# EAGLE schematic Adafruit Proto Tripler PiCowbell (EAGLE 9.6.2)
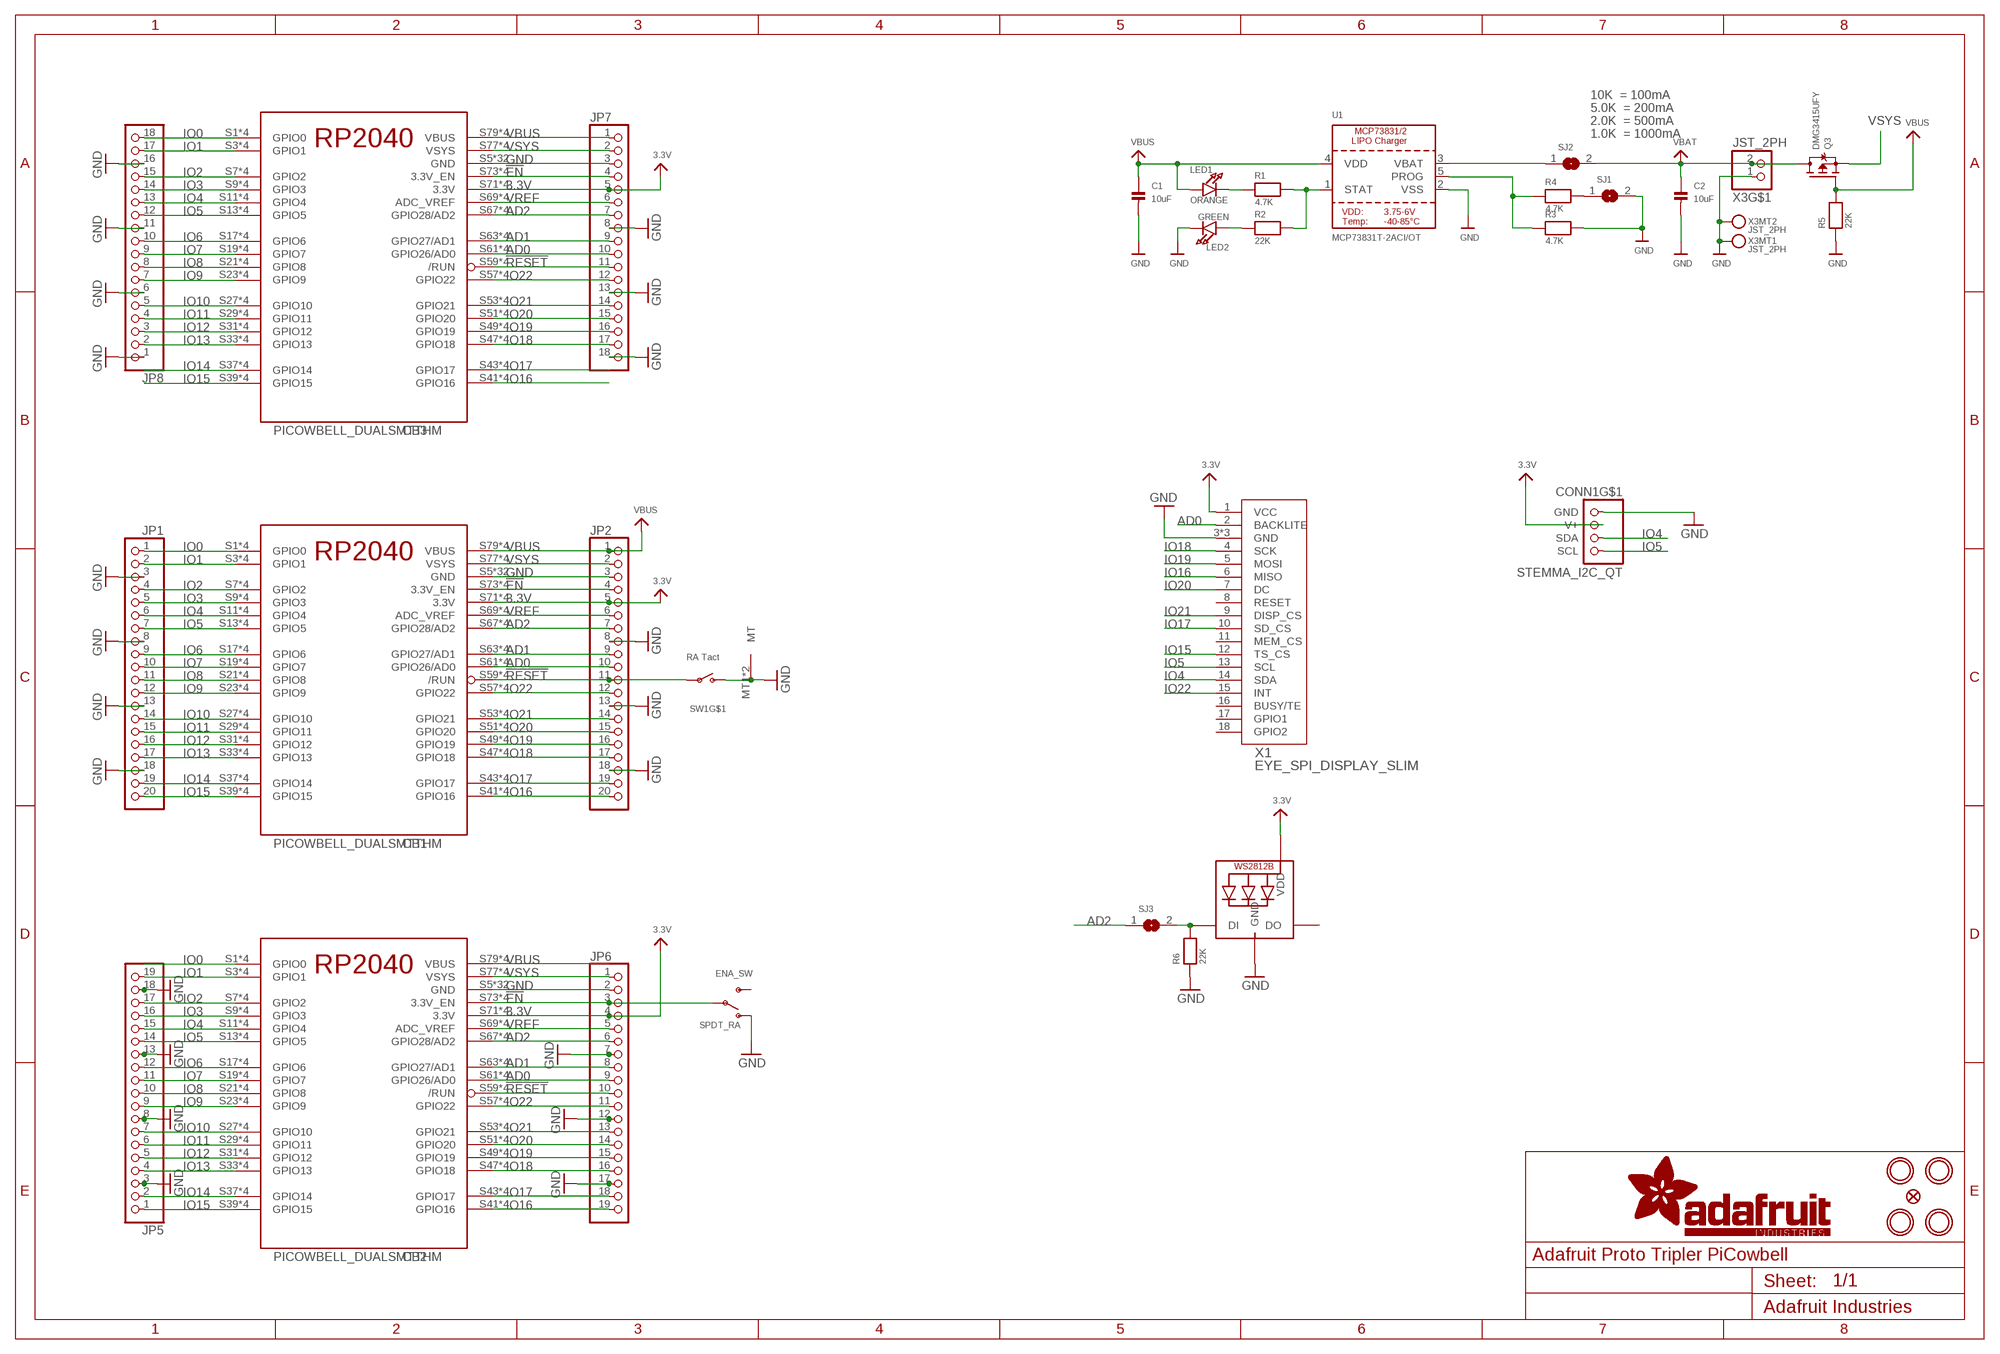
[diagram p0: schematic, sheet 1]

## Parts
C1  10uF  CAP_CERAMIC0805-NOOUTLINE  [0805-NO]
C2  10uF  CAP_CERAMIC0805-NOOUTLINE  [0805-NO]
CB1  PICOWBELL_DUALSMTTHM  [PICOWBELL_DUALSMTTHM]
CB2  PICOWBELL_DUALSMTTHM  [PICOWBELL_DUALSMTTHM]
CB3  PICOWBELL_DUALSMTTHM  [PICOWBELL_DUALSMTTHM]
CONN1  STEMMA_I2C_QT  [JST_SH4]
ENA_SW  SPDT_RA  SWITCH_SPDT  [SPDT_SMT_SSSS811101]
FID2  FIDUCIAL_1MM  [FIDUCIAL_1MM]
JP1  HEADER-1X20_70MIL  [1X20_ROUND_70MIL]
JP2  HEADER-1X20_70MIL  [1X20_ROUND_70MIL]
JP5  HEADER-1X19  [1X19_ROUND]
JP6  HEADER-1X19  [1X19_ROUND]
JP7  HEADER-1X18  [1X18_ROUND70]
JP8  HEADER-1X18  [1X18_ROUND70]
LED1  ORANGE  LED0603_NOOUTLINE  [CHIPLED_0603_NOOUTLINE]
LED2  GREEN  LED0603_NOOUTLINE  [CHIPLED_0603_NOOUTLINE]
LED3  WS2812B_3535FULL  [LED3535_FULLPADS]
Q3  DMG3415UFY  MOSFET-P_DFN2015  [DFN2015-3]
R1  4.7K  RESISTOR_0402NO  [_0402NO]
R2  22K  RESISTOR_0402NO  [_0402NO]
R3  4.7K  RESISTOR_0402NO  [_0402NO]
R4  4.7K  RESISTOR_0402NO  [_0402NO]
R5  22K  RESISTOR_0402NO  [_0402NO]
R6  22K  RESISTOR_0402NO  [_0402NO]
SJ1  SOLDERJUMPERCLOSED  [SOLDERJUMPER_CLOSEDWIRE]
SJ2  SOLDERJUMPERCLOSED  [SOLDERJUMPER_CLOSEDWIRE]
SJ3  SOLDERJUMPERCLOSED  [SOLDERJUMPER_CLOSEDWIRE]
SW1  RA Tact  SWITCH_SPST_MNT_TACT_RA  [SPST_TACTILE_RA]
U1  MCP73831T-2ACI/OT  MCP73831/2  [SOT23-5]
U$5  MOUNTINGHOLE2.5  [MOUNTINGHOLE_2.5_PLATED]
U$7  MOUNTINGHOLE2.5  [MOUNTINGHOLE_2.5_PLATED]
U$15  MOUNTINGHOLE2.5  [MOUNTINGHOLE_2.5_PLATED]
U$16  MOUNTINGHOLE2.5  [MOUNTINGHOLE_2.5_PLATED]
X1  EYE_SPI_DISPLAY_SLIM  [EYE_SPI_DISPLAY_SLIM]
X3  JST_2PH  CON_JST_PH_2PIN_MT_BATT  [JSTPH2_BATT]

## Nets
3.3V [3V]: CB1.S71(3.3V) CB1.S72(3.3V) CB1.T71(3.3V) CB1.T72(3.3V) CB2.S71(3.3V) CB2.S72(3.3V) CB2.T71(3.3V) CB2.T72(3.3V) CB3.S71(3.3V) CB3.S72(3.3V) CB3.T71(3.3V) CB3.T72(3.3V) CONN1.2(V+) JP2.5 JP6.4 JP7.5 LED3.2(VDD) X1.1(VCC)
!EN: CB1.S73(3.3V_EN) CB1.S74(3.3V_EN) CB1.T73(3.3V_EN) CB1.T74(3.3V_EN) CB2.S73(3.3V_EN) CB2.S74(3.3V_EN) CB2.T73(3.3V_EN) CB2.T74(3.3V_EN) CB3.S73(3.3V_EN) CB3.S74(3.3V_EN) CB3.T73(3.3V_EN) CB3.T74(3.3V_EN) ENA_SW.B(P) JP2.4 JP6.3 JP7.4
!RESET: CB1.S59(/RUN) CB1.S60(/RUN) CB1.T59(/RUN) CB1.T60(/RUN) CB2.S59(/RUN) CB2.S60(/RUN) CB2.T59(/RUN) CB2.T60(/RUN) CB3.S59(/RUN) CB3.S60(/RUN) CB3.T59(/RUN) CB3.T60(/RUN) JP2.11 JP6.10 JP7.11 SW1.1(P)
AD0: CB1.S61(GPIO26/AD0) CB1.S62(GPIO26/AD0) CB1.T61(GPIO26/AD0) CB1.T62(GPIO26/AD0) CB2.S61(GPIO26/AD0) CB2.S62(GPIO26/AD0) CB2.T61(GPIO26/AD0) CB2.T62(GPIO26/AD0) CB3.S61(GPIO26/AD0) CB3.S62(GPIO26/AD0) CB3.T61(GPIO26/AD0) CB3.T62(GPIO26/AD0) JP2.10 JP6.9 JP7.10 X1.2(BACKLITE)
AD1: CB1.S63(GPIO27/AD1) CB1.S64(GPIO27/AD1) CB1.T63(GPIO27/AD1) CB1.T64(GPIO27/AD1) CB2.S63(GPIO27/AD1) CB2.S64(GPIO27/AD1) CB2.T63(GPIO27/AD1) CB2.T64(GPIO27/AD1) CB3.S63(GPIO27/AD1) CB3.S64(GPIO27/AD1) CB3.T63(GPIO27/AD1) CB3.T64(GPIO27/AD1) JP2.9 JP6.8 JP7.9
AD2: CB1.S67(GPIO28/AD2) CB1.S68(GPIO28/AD2) CB1.T67(GPIO28/AD2) CB1.T68(GPIO28/AD2) CB2.S67(GPIO28/AD2) CB2.S68(GPIO28/AD2) CB2.T67(GPIO28/AD2) CB2.T68(GPIO28/AD2) CB3.S67(GPIO28/AD2) CB3.S68(GPIO28/AD2) CB3.T67(GPIO28/AD2) CB3.T68(GPIO28/AD2) JP2.7 JP6.6 JP7.7 SJ3.1
GND [GND]: C1.2 C2.2 CB1.S5(GND) CB1.S6(GND) CB1.S15(GND) CB1.S16(GND) CB1.S25(GND) CB1.S26(GND) CB1.S35(GND) CB1.S36(GND) CB1.S45(GND) CB1.S46(GND) CB1.S55(GND) CB1.S56(GND) CB1.S65(GND) CB1.S66(GND) CB1.S75(GND) CB1.S76(GND) CB1.T5(GND) CB1.T6(GND) CB1.T15(GND) CB1.T16(GND) CB1.T25(GND) CB1.T26(GND) CB1.T35(GND) CB1.T36(GND) CB1.T45(GND) CB1.T46(GND) CB1.T55(GND) CB1.T56(GND) CB1.T65(GND) CB1.T66(GND) CB1.T75(GND) CB1.T76(GND) CB2.S5(GND) CB2.S6(GND) CB2.S15(GND) CB2.S16(GND) CB2.S25(GND) CB2.S26(GND) CB2.S35(GND) CB2.S36(GND) CB2.S45(GND) CB2.S46(GND) CB2.S55(GND) CB2.S56(GND) CB2.S65(GND) CB2.S66(GND) CB2.S75(GND) CB2.S76(GND) CB2.T5(GND) CB2.T6(GND) CB2.T15(GND) CB2.T16(GND) CB2.T25(GND) CB2.T26(GND) CB2.T35(GND) CB2.T36(GND) CB2.T45(GND) CB2.T46(GND) CB2.T55(GND) CB2.T56(GND) CB2.T65(GND) CB2.T66(GND) CB2.T75(GND) CB2.T76(GND) CB3.S5(GND) CB3.S6(GND) CB3.S15(GND) CB3.S16(GND) CB3.S25(GND) CB3.S26(GND) CB3.S35(GND) CB3.S36(GND) CB3.S45(GND) CB3.S46(GND) CB3.S55(GND) CB3.S56(GND) CB3.S65(GND) CB3.S66(GND) CB3.S75(GND) CB3.S76(GND) CB3.T5(GND) CB3.T6(GND) CB3.T15(GND) CB3.T16(GND) CB3.T25(GND) CB3.T26(GND) CB3.T35(GND) CB3.T36(GND) CB3.T45(GND) CB3.T46(GND) CB3.T55(GND) CB3.T56(GND) CB3.T65(GND) CB3.T66(GND) CB3.T75(GND) CB3.T76(GND) CONN1.1(GND) ENA_SW.A(O) JP1.3 JP1.8 JP1.13 JP1.18 JP2.3 JP2.8 JP2.13 JP2.18 JP5.3 JP5.8 JP5.13 JP5.18 JP6.2 JP6.7 JP6.12 JP6.17 JP7.3 JP7.8 JP7.13 JP7.18 JP8.1 JP8.6 JP8.11 JP8.16 LED2.C LED3.4(GND) R3.2 R5.1 R6.1 SJ1.2 SW1.2(S) SW1.MT1(MT) SW1.MT2(MT) U1.2(VSS) X1.3(GND) X1.SUPPORT1(GND) X1.SUPPORT2(GND) X3.1 X3.NC1 X3.NC2
IO0: CB1.S1(GPIO0) CB1.S2(GPIO0) CB1.T1(GPIO0) CB1.T2(GPIO0) CB2.S1(GPIO0) CB2.S2(GPIO0) CB2.T1(GPIO0) CB2.T2(GPIO0) CB3.S1(GPIO0) CB3.S2(GPIO0) CB3.T1(GPIO0) CB3.T2(GPIO0) JP1.1 JP8.18
IO1: CB1.S3(GPIO1) CB1.S4(GPIO1) CB1.T3(GPIO1) CB1.T4(GPIO1) CB2.S3(GPIO1) CB2.S4(GPIO1) CB2.T3(GPIO1) CB2.T4(GPIO1) CB3.S3(GPIO1) CB3.S4(GPIO1) CB3.T3(GPIO1) CB3.T4(GPIO1) JP1.2 JP5.19 JP8.17
IO2: CB1.S7(GPIO2) CB1.S8(GPIO2) CB1.T7(GPIO2) CB1.T8(GPIO2) CB2.S7(GPIO2) CB2.S8(GPIO2) CB2.T7(GPIO2) CB2.T8(GPIO2) CB3.S7(GPIO2) CB3.S8(GPIO2) CB3.T7(GPIO2) CB3.T8(GPIO2) JP1.4 JP5.17 JP8.15
IO3: CB1.S9(GPIO3) CB1.S10(GPIO3) CB1.T9(GPIO3) CB1.T10(GPIO3) CB2.S9(GPIO3) CB2.S10(GPIO3) CB2.T9(GPIO3) CB2.T10(GPIO3) CB3.S9(GPIO3) CB3.S10(GPIO3) CB3.T9(GPIO3) CB3.T10(GPIO3) JP1.5 JP5.16 JP8.14
IO4: CB1.S11(GPIO4) CB1.S12(GPIO4) CB1.T11(GPIO4) CB1.T12(GPIO4) CB2.S11(GPIO4) CB2.S12(GPIO4) CB2.T11(GPIO4) CB2.T12(GPIO4) CB3.S11(GPIO4) CB3.S12(GPIO4) CB3.T11(GPIO4) CB3.T12(GPIO4) CONN1.3(SDA) JP1.6 JP5.15 JP8.13 X1.14(SDA)
IO5: CB1.S13(GPIO5) CB1.S14(GPIO5) CB1.T13(GPIO5) CB1.T14(GPIO5) CB2.S13(GPIO5) CB2.S14(GPIO5) CB2.T13(GPIO5) CB2.T14(GPIO5) CB3.S13(GPIO5) CB3.S14(GPIO5) CB3.T13(GPIO5) CB3.T14(GPIO5) CONN1.4(SCL) JP1.7 JP5.14 JP8.12 X1.13(SCL)
IO6: CB1.S17(GPIO6) CB1.S18(GPIO6) CB1.T17(GPIO6) CB1.T18(GPIO6) CB2.S17(GPIO6) CB2.S18(GPIO6) CB2.T17(GPIO6) CB2.T18(GPIO6) CB3.S17(GPIO6) CB3.S18(GPIO6) CB3.T17(GPIO6) CB3.T18(GPIO6) JP1.9 JP5.12 JP8.10
IO7: CB1.S19(GPIO7) CB1.S20(GPIO7) CB1.T19(GPIO7) CB1.T20(GPIO7) CB2.S19(GPIO7) CB2.S20(GPIO7) CB2.T19(GPIO7) CB2.T20(GPIO7) CB3.S19(GPIO7) CB3.S20(GPIO7) CB3.T19(GPIO7) CB3.T20(GPIO7) JP1.10 JP5.11 JP8.9
IO8: CB1.S21(GPIO8) CB1.S22(GPIO8) CB1.T21(GPIO8) CB1.T22(GPIO8) CB2.S21(GPIO8) CB2.S22(GPIO8) CB2.T21(GPIO8) CB2.T22(GPIO8) CB3.S21(GPIO8) CB3.S22(GPIO8) CB3.T21(GPIO8) CB3.T22(GPIO8) JP1.11 JP5.10 JP8.8
IO9: CB1.S23(GPIO9) CB1.S24(GPIO9) CB1.T23(GPIO9) CB1.T24(GPIO9) CB2.S23(GPIO9) CB2.S24(GPIO9) CB2.T23(GPIO9) CB2.T24(GPIO9) CB3.S23(GPIO9) CB3.S24(GPIO9) CB3.T23(GPIO9) CB3.T24(GPIO9) JP1.12 JP5.9 JP8.7
IO10: CB1.S27(GPIO10) CB1.S28(GPIO10) CB1.T27(GPIO10) CB1.T28(GPIO10) CB2.S27(GPIO10) CB2.S28(GPIO10) CB2.T27(GPIO10) CB2.T28(GPIO10) CB3.S27(GPIO10) CB3.S28(GPIO10) CB3.T27(GPIO10) CB3.T28(GPIO10) JP1.14 JP5.7 JP8.5
IO11: CB1.S29(GPIO11) CB1.S30(GPIO11) CB1.T29(GPIO11) CB1.T30(GPIO11) CB2.S29(GPIO11) CB2.S30(GPIO11) CB2.T29(GPIO11) CB2.T30(GPIO11) CB3.S29(GPIO11) CB3.S30(GPIO11) CB3.T29(GPIO11) CB3.T30(GPIO11) JP1.15 JP5.6 JP8.4
IO12: CB1.S31(GPIO12) CB1.S32(GPIO12) CB1.T31(GPIO12) CB1.T32(GPIO12) CB2.S31(GPIO12) CB2.S32(GPIO12) CB2.T31(GPIO12) CB2.T32(GPIO12) CB3.S31(GPIO12) CB3.S32(GPIO12) CB3.T31(GPIO12) CB3.T32(GPIO12) JP1.16 JP5.5 JP8.3
IO13: CB1.S33(GPIO13) CB1.S34(GPIO13) CB1.T33(GPIO13) CB1.T34(GPIO13) CB2.S33(GPIO13) CB2.S34(GPIO13) CB2.T33(GPIO13) CB2.T34(GPIO13) CB3.S33(GPIO13) CB3.S34(GPIO13) CB3.T33(GPIO13) CB3.T34(GPIO13) JP1.17 JP5.4 JP8.2
IO14: CB1.S37(GPIO14) CB1.S38(GPIO14) CB1.T37(GPIO14) CB1.T38(GPIO14) CB2.S37(GPIO14) CB2.S38(GPIO14) CB2.T37(GPIO14) CB2.T38(GPIO14) CB3.S37(GPIO14) CB3.S38(GPIO14) CB3.T37(GPIO14) CB3.T38(GPIO14) JP1.19 JP5.2
IO15: CB1.S39(GPIO15) CB1.S40(GPIO15) CB1.T39(GPIO15) CB1.T40(GPIO15) CB2.S39(GPIO15) CB2.S40(GPIO15) CB2.T39(GPIO15) CB2.T40(GPIO15) CB3.S39(GPIO15) CB3.S40(GPIO15) CB3.T39(GPIO15) CB3.T40(GPIO15) JP1.20 JP5.1 X1.12(TS_CS)
IO16: CB1.S41(GPIO16) CB1.S42(GPIO16) CB1.T41(GPIO16) CB1.T42(GPIO16) CB2.S41(GPIO16) CB2.S42(GPIO16) CB2.T41(GPIO16) CB2.T42(GPIO16) CB3.S41(GPIO16) CB3.S42(GPIO16) CB3.T41(GPIO16) CB3.T42(GPIO16) JP2.20 JP6.19 X1.6(MISO)
IO17: CB1.S43(GPIO17) CB1.S44(GPIO17) CB1.T43(GPIO17) CB1.T44(GPIO17) CB2.S43(GPIO17) CB2.S44(GPIO17) CB2.T43(GPIO17) CB2.T44(GPIO17) CB3.S43(GPIO17) CB3.S44(GPIO17) CB3.T43(GPIO17) CB3.T44(GPIO17) JP2.19 JP6.18 X1.10(SD_CS)
IO18: CB1.S47(GPIO18) CB1.S48(GPIO18) CB1.T47(GPIO18) CB1.T48(GPIO18) CB2.S47(GPIO18) CB2.S48(GPIO18) CB2.T47(GPIO18) CB2.T48(GPIO18) CB3.S47(GPIO18) CB3.S48(GPIO18) CB3.T47(GPIO18) CB3.T48(GPIO18) JP2.17 JP6.16 JP7.17 X1.4(SCK)
IO19: CB1.S49(GPIO19) CB1.S50(GPIO19) CB1.T49(GPIO19) CB1.T50(GPIO19) CB2.S49(GPIO19) CB2.S50(GPIO19) CB2.T49(GPIO19) CB2.T50(GPIO19) CB3.S49(GPIO19) CB3.S50(GPIO19) CB3.T49(GPIO19) CB3.T50(GPIO19) JP2.16 JP6.15 JP7.16 X1.5(MOSI)
IO20: CB1.S51(GPIO20) CB1.S52(GPIO20) CB1.T51(GPIO20) CB1.T52(GPIO20) CB2.S51(GPIO20) CB2.S52(GPIO20) CB2.T51(GPIO20) CB2.T52(GPIO20) CB3.S51(GPIO20) CB3.S52(GPIO20) CB3.T51(GPIO20) CB3.T52(GPIO20) JP2.15 JP6.14 JP7.15 X1.7(DC)
IO21: CB1.S53(GPIO21) CB1.S54(GPIO21) CB1.T53(GPIO21) CB1.T54(GPIO21) CB2.S53(GPIO21) CB2.S54(GPIO21) CB2.T53(GPIO21) CB2.T54(GPIO21) CB3.S53(GPIO21) CB3.S54(GPIO21) CB3.T53(GPIO21) CB3.T54(GPIO21) JP2.14 JP6.13 JP7.14 X1.9(DISP_CS)
IO22: CB1.S57(GPIO22) CB1.S58(GPIO22) CB1.T57(GPIO22) CB1.T58(GPIO22) CB2.S57(GPIO22) CB2.S58(GPIO22) CB2.T57(GPIO22) CB2.T58(GPIO22) CB3.S57(GPIO22) CB3.S58(GPIO22) CB3.T57(GPIO22) CB3.T58(GPIO22) JP2.12 JP6.11 JP7.12 X1.15(INT)
N$1: R4.2 SJ1.1
N$2: SJ2.1 U1.3(VBAT)
N$4: LED1.C R1.1
N$5: R1.2 R2.2 U1.1(STAT)
N$7: LED2.A R2.1
N$8: R3.1 R4.1 U1.5(PROG)
N$11: LED3.1(DI) R6.2 SJ3.2
VBAT: C2.1 Q3.3(D) SJ2.2 X3.2
VBUS [VBUS]: C1.1 CB1.S79(VBUS) CB1.S80(VBUS) CB1.T79(VBUS) CB1.T80(VBUS) CB2.S79(VBUS) CB2.S80(VBUS) CB2.T79(VBUS) CB2.T80(VBUS) CB3.S79(VBUS) CB3.S80(VBUS) CB3.T79(VBUS) CB3.T80(VBUS) JP2.1 JP7.1 LED1.A Q3.1(G) R5.2 U1.4(VDD)
VREF: CB1.S69(ADC_VREF) CB1.S70(ADC_VREF) CB1.T69(ADC_VREF) CB1.T70(ADC_VREF) CB2.S69(ADC_VREF) CB2.S70(ADC_VREF) CB2.T69(ADC_VREF) CB2.T70(ADC_VREF) CB3.S69(ADC_VREF) CB3.S70(ADC_VREF) CB3.T69(ADC_VREF) CB3.T70(ADC_VREF) JP2.6 JP6.5 JP7.6
VSYS [VSYS]: CB1.S77(VSYS) CB1.S78(VSYS) CB1.T77(VSYS) CB1.T78(VSYS) CB2.S77(VSYS) CB2.S78(VSYS) CB2.T77(VSYS) CB2.T78(VSYS) CB3.S77(VSYS) CB3.S78(VSYS) CB3.T77(VSYS) CB3.T78(VSYS) JP2.2 JP6.1 JP7.2 Q3.2(S)
Unconnected: CONN1.MT1(MT) CONN1.MT2(MT) ENA_SW.C(S) LED3.3(DO) X1.8(RESET) X1.11(MEM_CS) X1.16(BUSY/TE) X1.17(GPIO1) X1.18(GPIO2)

## Notes on the sheet
- 10K  = 100mA
- 5.0K  = 200mA
- 2.0K  = 500mA
- 1.0K  = 1000mA

## Library data of the parts
C1 C2 = microbuilder:CAP_CERAMIC: Ceramic Capacitors For new designs, use the packages preceded by an '_' character since they are more reliable: The following footprints should be used on most boards: _0402 - Standard footprint for regular board layouts _0603 - Standard footprint for regular board layouts _0805 - Standard footprint for regular board layouts _1206 - Standard footprint for regular board layouts For extremely tight-pitch boards where space is at a premium, the following 'micro-pitch' footprints can be used (smaller pads, no silkscreen outline, etc.): _0402MP - Micro-pitch footprint for very dense/compact boards _0603MP - Micro-pitch footprint for very dense/compact boards _0805MP - Micro-pitch footprint for very dense/compact boards _1206MP - Micro-pitch footprint for very dense/compact boards
CB1-CB3 = adafruit_micro:PICOWBELL
CONN1 = adafruit_electromech:STEMMA_I2C; LCSC: C2845363
ENA_SW = adafruit_electromech:SWITCH_SPDT: Switch - SPDT SSSS811101 - Horizontal Two Position SMT, 0.3A 4V [Mouser: 688-SSSS811101]
FID2 = microbuilder:FIDUCIAL: Fiducial Alignment Points Various fiducial points for machine vision alignment.; BOM: EXCLUDE
JP1 JP2 = adafruit_electromech:HEADER-1X20
JP5 JP6 = microbuilder:HEADER-1X19
JP7 JP8 = microbuilder:HEADER-1X18: Header 1x18
LED1 LED2 = microbuilder:LED: LED 0603 - 0603 Surface Mount Package 2mA: Green LED - Low Power (3.9mcd, 2ma, 1.7Vf) - Digikey: 475-2709-2-ND Orange LED - Low Power (9.8mcd, 2ma, 1.8Vf) - Digikey: 475-1194-2-ND Red LED - Low Power (5mcd, 2ma, 1.8Vf) - Digikey: 475-1195-2-ND Yellow LED - Low Power (7mcd, 2ma, 1.8Vf) - Digikey: 475-1196-2-ND 5mA: Blue LED - Low Power (17mcd, 5ma, 2.9Vf) - Digikey: LNJ937W8CRACT-ND 0805 - 0805 Surface Mount Package 2mA: Red LED (8.8mcd, 2mA, 1.8Vf, Clear) - Low Power [Digikey: 475-2510-1-ND] Green LED (5mcd, 2mA, 1.8Vf, Clear) - Low Power [Digikey: 475-2730-1-ND] Yellow LED (11.3mcd, 2mA, 1.8Vf, Clear) - Low Power [Digikey: 475-2555-1-ND] 20mA: Red LED (104mcd, 20mA, Diffused) - LS R976 [Digikey: 475-1278-6-ND] Red LED (12mcd, 20mA, 2.0Vf, Clear) - APT2012EC [Digikey: 754-1128-1-ND] Green LED (15mcd, 20mA, 2.2Vf, Clear) - APT2012GC [Digikey: 754-1131-1-ND] Orange LED (160mcd, 20mA, 2.1Vf, Clear) - APT2012SECK [Digikey: 754-1130-1-ND] 1206 - 1206 Surface Mount Package Green LED (26mcd, 20mA, Diffused) - LG N971 [Digikey: 475-1407-6-ND] Red LED (15mcd, 20mA, Diffused) - LH N974 [Digikey: 475-1416-6-ND] Cree - Cree High-Power Surface Mount LEDs XPEBWT-L1-0000-00D50 - White 111lm 350mA 2.9Vf 6200K 110° XTEAWT-00-0000-00000LEE3 - White 114lm 350mA 2.85Vf 5000K 115° Everlight - Everlight 45-21 Series Surface Mount LEDs 45-21/QK2C-B2832AC2CB2/2T - Warm White 2000mcd 20mA 3.25Vf 3050K 120° 45-21/LK2C-B38452C4CB2/2T - Nuetral White 2000mcd 20mA 3.25Vf 4150K 120° 45-21/LK2C-B50634C6CB2/2T - Cold White 2200mcd 20mA 3.25Vf 5650K 120° PLCC2 Reverse Mount LS T77K-J1L2-1-0-2-R18-Z - Red 11.25mcd 2mA 1.8Vf 630nm 120° LO T77K-L1M2-24-Z - Orange 19.6mcd 2mA 1.8Vf 606nm 120° LY T77K-K2M1-26-Z - Yellow 15.7mcd 2mA 1.8Vf 587nm 120°; JLC_ROTATION: 270
LED3 = microbuilder:WS2812B; ROT: 180
Q3 = microbuilder:MOSFET-P: P-Channel Mosfet LEGEND VDS: Voltage Drain-Source ID: Drain Current RDS(ON): Drain-Source On-State Resistance VGS(TH): Gate-Source Threshold Voltage CISS: Drain-Source Input Capacitance SOT-23 Name VDS ID RDS(ON) VGS(TH) CISS Order Number IRLML5103 30V 760mA 600 mOhm -- 75pF @ 25V Digikey: IRLML5103PBFCT-ND IRLML6401 12V 4.3A 50 mOhm 950mV @ 250µA 830pF @ 10V Digikey: IRLML6401PBFTR-ND NTR0202PL 20V 400mA 800 mOhm 2.3V @ 250uA 70pF @ 5V Digikey: NTR0202PLT1GOSTR-ND NTR4101PT1G 20V 1.8A 85 mOhm 1.2V @ 250uA 675pF @ 10V Digikey: NTR4101PT1GOSCT-ND DMP2004K 20V 600mA 900 mOhm 1V @ 250uA 175pF @ 16V Digikey: DMP2004KDICT-ND PMV65XP 20V 3.9A 76 mOhm 950mV @ 1mA 725pF @ 20V Digikey: 568-2358-2-ND TO-252 Name VDS ID RDS(ON) VGS(TH) CISS Order Number AOD417 30V 25A 34 mOhm 3V @ 250µA 920pF @ 15V Digikey: 785-1106-2-ND PowerPak Name VDS ID RDS(ON) VGS(TH) CISS Order Number AON7401 30V 12A 14 mOhm 3V @ 250µA 2600pF @ 15V Digikey: 785-1302-1-ND
R1-R6 = microbuilder:RESISTOR: Resistors For new designs, use the packages preceded by an '_' character since they are more reliable: The following footprints should be used on most boards: _0402 - Standard footprint for regular board layouts _0603 - Standard footprint for regular board layouts _0805 - Standard footprint for regular board layouts _1206 - Standard footprint for regular board layouts For extremely tight-pitch boards where space is at a premium, the following 'micro-pitch' footprints can be used (smaller pads, no silkscreen outline, etc.): _0402MP - Micro-pitch footprint for very dense/compact boards _0603MP - Micro-pitch footprint for very dense/compact boards _0805MP - Micro-pitch footprint for very dense/compact boards _1206MP - Micro-pitch footprint for very dense/compact boards
SJ1-SJ3 = microbuilder:SOLDERJUMPER: SMD Solder JUMPER Solder the two pads together to create a connection, or remove the solder to break it. REFLOW - Use this footprint for solder paste and reflow ovens. WAVE - Use this footprint for hand-soldering (larger pads). CLOSED - Has a trace between the two pads to ensure it is closed by default. The trace needs to be cut to disable the jumper, and can be closed again by creating a solder bridge between the two pads.
SW1 = adafruit_electromech:SWITCH_SPST_MNT: Switch - SPST 4UCon 19192 (6.7x2.6mm SMT); LCSC: C778159
U1 = microbuilder:MCP73831/2: MCP73831/2 LIPO Charger VDD: 3.75 - 6V Temp -40 - 85°C Programmable Charge Rate: 15-500mA NOTE: STAT is a tri-state logic output on the MCP73831 and an open-drain output on the MCP73832. SOT23-5 with 4.2V output and tri-state logic on STAT = MCP73831T-2ACI/OT; JLC_ROTATION: 0; LCSC: C424093
U$5 U$7 U$15 U$16 = adafruit_electromech:MOUNTINGHOLE: Mounting Hole For #2 screws (0.086"/2.18mm width, 0.094"/2.4mm hole) use 2.5mm; BOM: EXCLUDE
X1 = adafruit_display:EYE_SPI_DISPLAY
X3 = adafruit_electromech:CON_JST_PH_2PIN_MT; LCSC: C47647

## Net classes
1 GND: width 0.406 mm
2 VBUS: width 0.406 mm
3 VSYS: width 0.406 mm
4 3V: width 0.406 mm